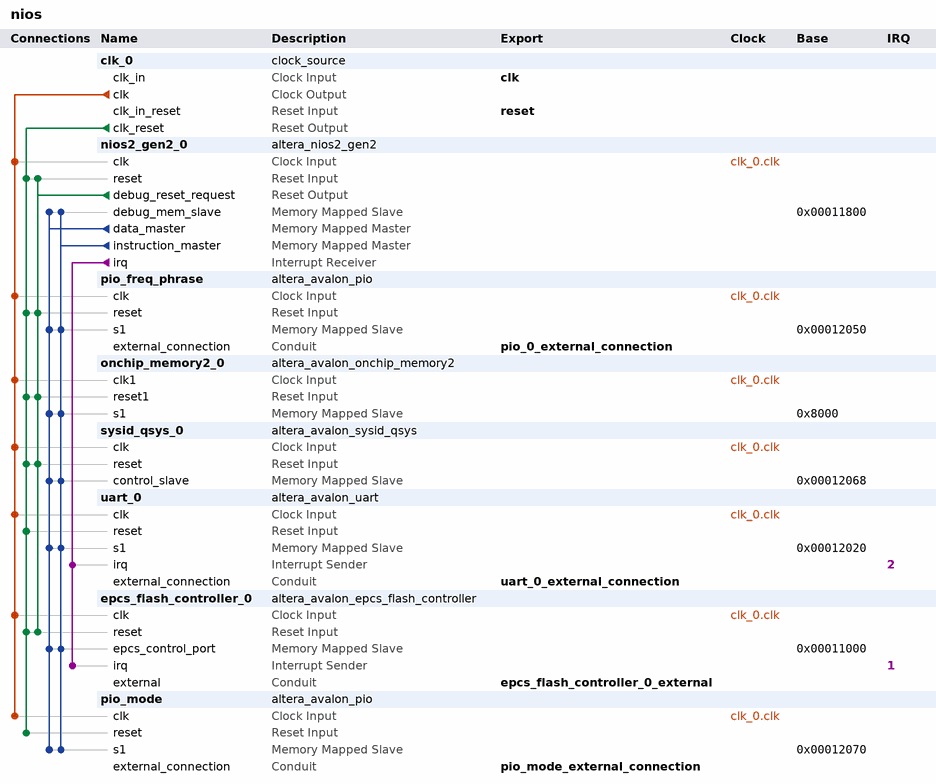
[diagram p0: system contents]
# Platform Designer (Qsys) system nios, Cyclone IV E EP4CE22E22C8
# Parameters at their usual value, and those the tool derives, are not listed.
package require -exact qsys 17.0
create_system nios
set_project_property DEVICE_FAMILY {Cyclone IV E}
set_project_property DEVICE EP4CE22E22C8

add_instance clk_0 clock_source 17.0
set_instance_parameter_value clk_0 clockFrequency 50000000

add_instance nios2_gen2_0 altera_nios2_gen2 17.0
set_instance_parameter_value nios2_gen2_0 dcache_size 2048
set_instance_parameter_value nios2_gen2_0 exceptionSlave onchip_memory2_0.s1
set_instance_parameter_value nios2_gen2_0 icache_size 4096
set_instance_parameter_value nios2_gen2_0 impl Tiny
set_instance_parameter_value nios2_gen2_0 resetSlave epcs_flash_controller_0.epcs_control_port

add_instance pio_freq_phrase altera_avalon_pio 17.0
set_instance_parameter_value pio_freq_phrase direction Output
set_instance_parameter_value pio_freq_phrase resetValue 593410
set_instance_parameter_value pio_freq_phrase width 22

add_instance onchip_memory2_0 altera_avalon_onchip_memory2 17.0
set_instance_parameter_value onchip_memory2_0 allowInSystemMemoryContentEditor true
set_instance_parameter_value onchip_memory2_0 dataWidth 32
set_instance_parameter_value onchip_memory2_0 dualPort false
set_instance_parameter_value onchip_memory2_0 initMemContent true
set_instance_parameter_value onchip_memory2_0 initializationFileName onchip_mem.hex
set_instance_parameter_value onchip_memory2_0 instanceID sys
set_instance_parameter_value onchip_memory2_0 memorySize 24000

add_instance sysid_qsys_0 altera_avalon_sysid_qsys 17.0
set_instance_parameter_value sysid_qsys_0 id 305419896

add_instance uart_0 altera_avalon_uart 17.0
set_instance_parameter_value uart_0 baud 57600
set_instance_parameter_value uart_0 dataBits 8
set_instance_parameter_value uart_0 fixedBaud true
set_instance_parameter_value uart_0 parity NONE
set_instance_parameter_value uart_0 stopBits 1
set_instance_parameter_value uart_0 syncRegDepth 3

add_instance epcs_flash_controller_0 altera_avalon_epcs_flash_controller 17.0
set_instance_parameter_value epcs_flash_controller_0 resetrequest_enabled true

add_instance pio_mode altera_avalon_pio 17.0
set_instance_parameter_value pio_mode direction Output
set_instance_parameter_value pio_mode resetValue 1
set_instance_parameter_value pio_mode width 1

# connections
add_connection clk_0.clk epcs_flash_controller_0.clk clock
add_connection clk_0.clk nios2_gen2_0.clk clock
add_connection clk_0.clk onchip_memory2_0.clk1 clock
add_connection clk_0.clk pio_freq_phrase.clk clock
add_connection clk_0.clk pio_mode.clk clock
add_connection clk_0.clk sysid_qsys_0.clk clock
add_connection clk_0.clk uart_0.clk clock
add_connection clk_0.clk_reset epcs_flash_controller_0.reset reset
add_connection clk_0.clk_reset nios2_gen2_0.reset reset
add_connection clk_0.clk_reset onchip_memory2_0.reset1 reset
add_connection clk_0.clk_reset pio_freq_phrase.reset reset
add_connection clk_0.clk_reset pio_mode.reset reset
add_connection clk_0.clk_reset sysid_qsys_0.reset reset
add_connection clk_0.clk_reset uart_0.reset reset
add_connection nios2_gen2_0.debug_reset_request epcs_flash_controller_0.reset reset
add_connection nios2_gen2_0.debug_reset_request nios2_gen2_0.reset reset
add_connection nios2_gen2_0.debug_reset_request onchip_memory2_0.reset1 reset
add_connection nios2_gen2_0.debug_reset_request pio_freq_phrase.reset reset
add_connection nios2_gen2_0.debug_reset_request sysid_qsys_0.reset reset
add_connection nios2_gen2_0.data_master epcs_flash_controller_0.epcs_control_port avalon
set_connection_parameter_value nios2_gen2_0.data_master/epcs_flash_controller_0.epcs_control_port baseAddress 0x00011000
add_connection nios2_gen2_0.data_master nios2_gen2_0.debug_mem_slave avalon
set_connection_parameter_value nios2_gen2_0.data_master/nios2_gen2_0.debug_mem_slave baseAddress 0x00011800
add_connection nios2_gen2_0.data_master onchip_memory2_0.s1 avalon
set_connection_parameter_value nios2_gen2_0.data_master/onchip_memory2_0.s1 baseAddress 0x8000
add_connection nios2_gen2_0.data_master pio_freq_phrase.s1 avalon
set_connection_parameter_value nios2_gen2_0.data_master/pio_freq_phrase.s1 baseAddress 0x00012050
add_connection nios2_gen2_0.data_master pio_mode.s1 avalon
set_connection_parameter_value nios2_gen2_0.data_master/pio_mode.s1 baseAddress 0x00012070
add_connection nios2_gen2_0.data_master sysid_qsys_0.control_slave avalon
set_connection_parameter_value nios2_gen2_0.data_master/sysid_qsys_0.control_slave baseAddress 0x00012068
add_connection nios2_gen2_0.data_master uart_0.s1 avalon
set_connection_parameter_value nios2_gen2_0.data_master/uart_0.s1 baseAddress 0x00012020
add_connection nios2_gen2_0.instruction_master epcs_flash_controller_0.epcs_control_port avalon
set_connection_parameter_value nios2_gen2_0.instruction_master/epcs_flash_controller_0.epcs_control_port baseAddress 0x00011000
add_connection nios2_gen2_0.instruction_master nios2_gen2_0.debug_mem_slave avalon
set_connection_parameter_value nios2_gen2_0.instruction_master/nios2_gen2_0.debug_mem_slave baseAddress 0x00011800
add_connection nios2_gen2_0.instruction_master onchip_memory2_0.s1 avalon
set_connection_parameter_value nios2_gen2_0.instruction_master/onchip_memory2_0.s1 baseAddress 0x8000
add_connection nios2_gen2_0.instruction_master pio_freq_phrase.s1 avalon
set_connection_parameter_value nios2_gen2_0.instruction_master/pio_freq_phrase.s1 baseAddress 0x00012050
add_connection nios2_gen2_0.instruction_master pio_mode.s1 avalon
set_connection_parameter_value nios2_gen2_0.instruction_master/pio_mode.s1 baseAddress 0x00012070
add_connection nios2_gen2_0.instruction_master sysid_qsys_0.control_slave avalon
set_connection_parameter_value nios2_gen2_0.instruction_master/sysid_qsys_0.control_slave baseAddress 0x00012068
add_connection nios2_gen2_0.instruction_master uart_0.s1 avalon
set_connection_parameter_value nios2_gen2_0.instruction_master/uart_0.s1 baseAddress 0x00012020
add_connection nios2_gen2_0.irq epcs_flash_controller_0.irq interrupt
set_connection_parameter_value nios2_gen2_0.irq/epcs_flash_controller_0.irq irqNumber 1
add_connection nios2_gen2_0.irq uart_0.irq interrupt
set_connection_parameter_value nios2_gen2_0.irq/uart_0.irq irqNumber 2

# exported interfaces
add_interface clk clock sink
set_interface_property clk EXPORT_OF clk_0.clk_in
add_interface epcs_flash_controller_0_external conduit end
set_interface_property epcs_flash_controller_0_external EXPORT_OF epcs_flash_controller_0.external
add_interface pio_0_external_connection conduit end
set_interface_property pio_0_external_connection EXPORT_OF pio_freq_phrase.external_connection
add_interface pio_mode_external_connection conduit end
set_interface_property pio_mode_external_connection EXPORT_OF pio_mode.external_connection
add_interface reset reset sink
set_interface_property reset EXPORT_OF clk_0.clk_in_reset
add_interface uart_0_external_connection conduit end
set_interface_property uart_0_external_connection EXPORT_OF uart_0.external_connection

set_interconnect_requirement {$system} qsys_mm.clockCrossingAdapter HANDSHAKE
set_interconnect_requirement {$system} qsys_mm.enableEccProtection TRUE
set_interconnect_requirement {$system} qsys_mm.insertDefaultSlave TRUE
set_interconnect_requirement {$system} qsys_mm.maxAdditionalLatency 1

save_system nios.qsys
